# Altium schematic sheet PCIE x1 Edge Connector Interface.SchDoc
size Tabloid; DrawnBy: Krutav Shah; SheetNumber: 4; SheetTotal: 6
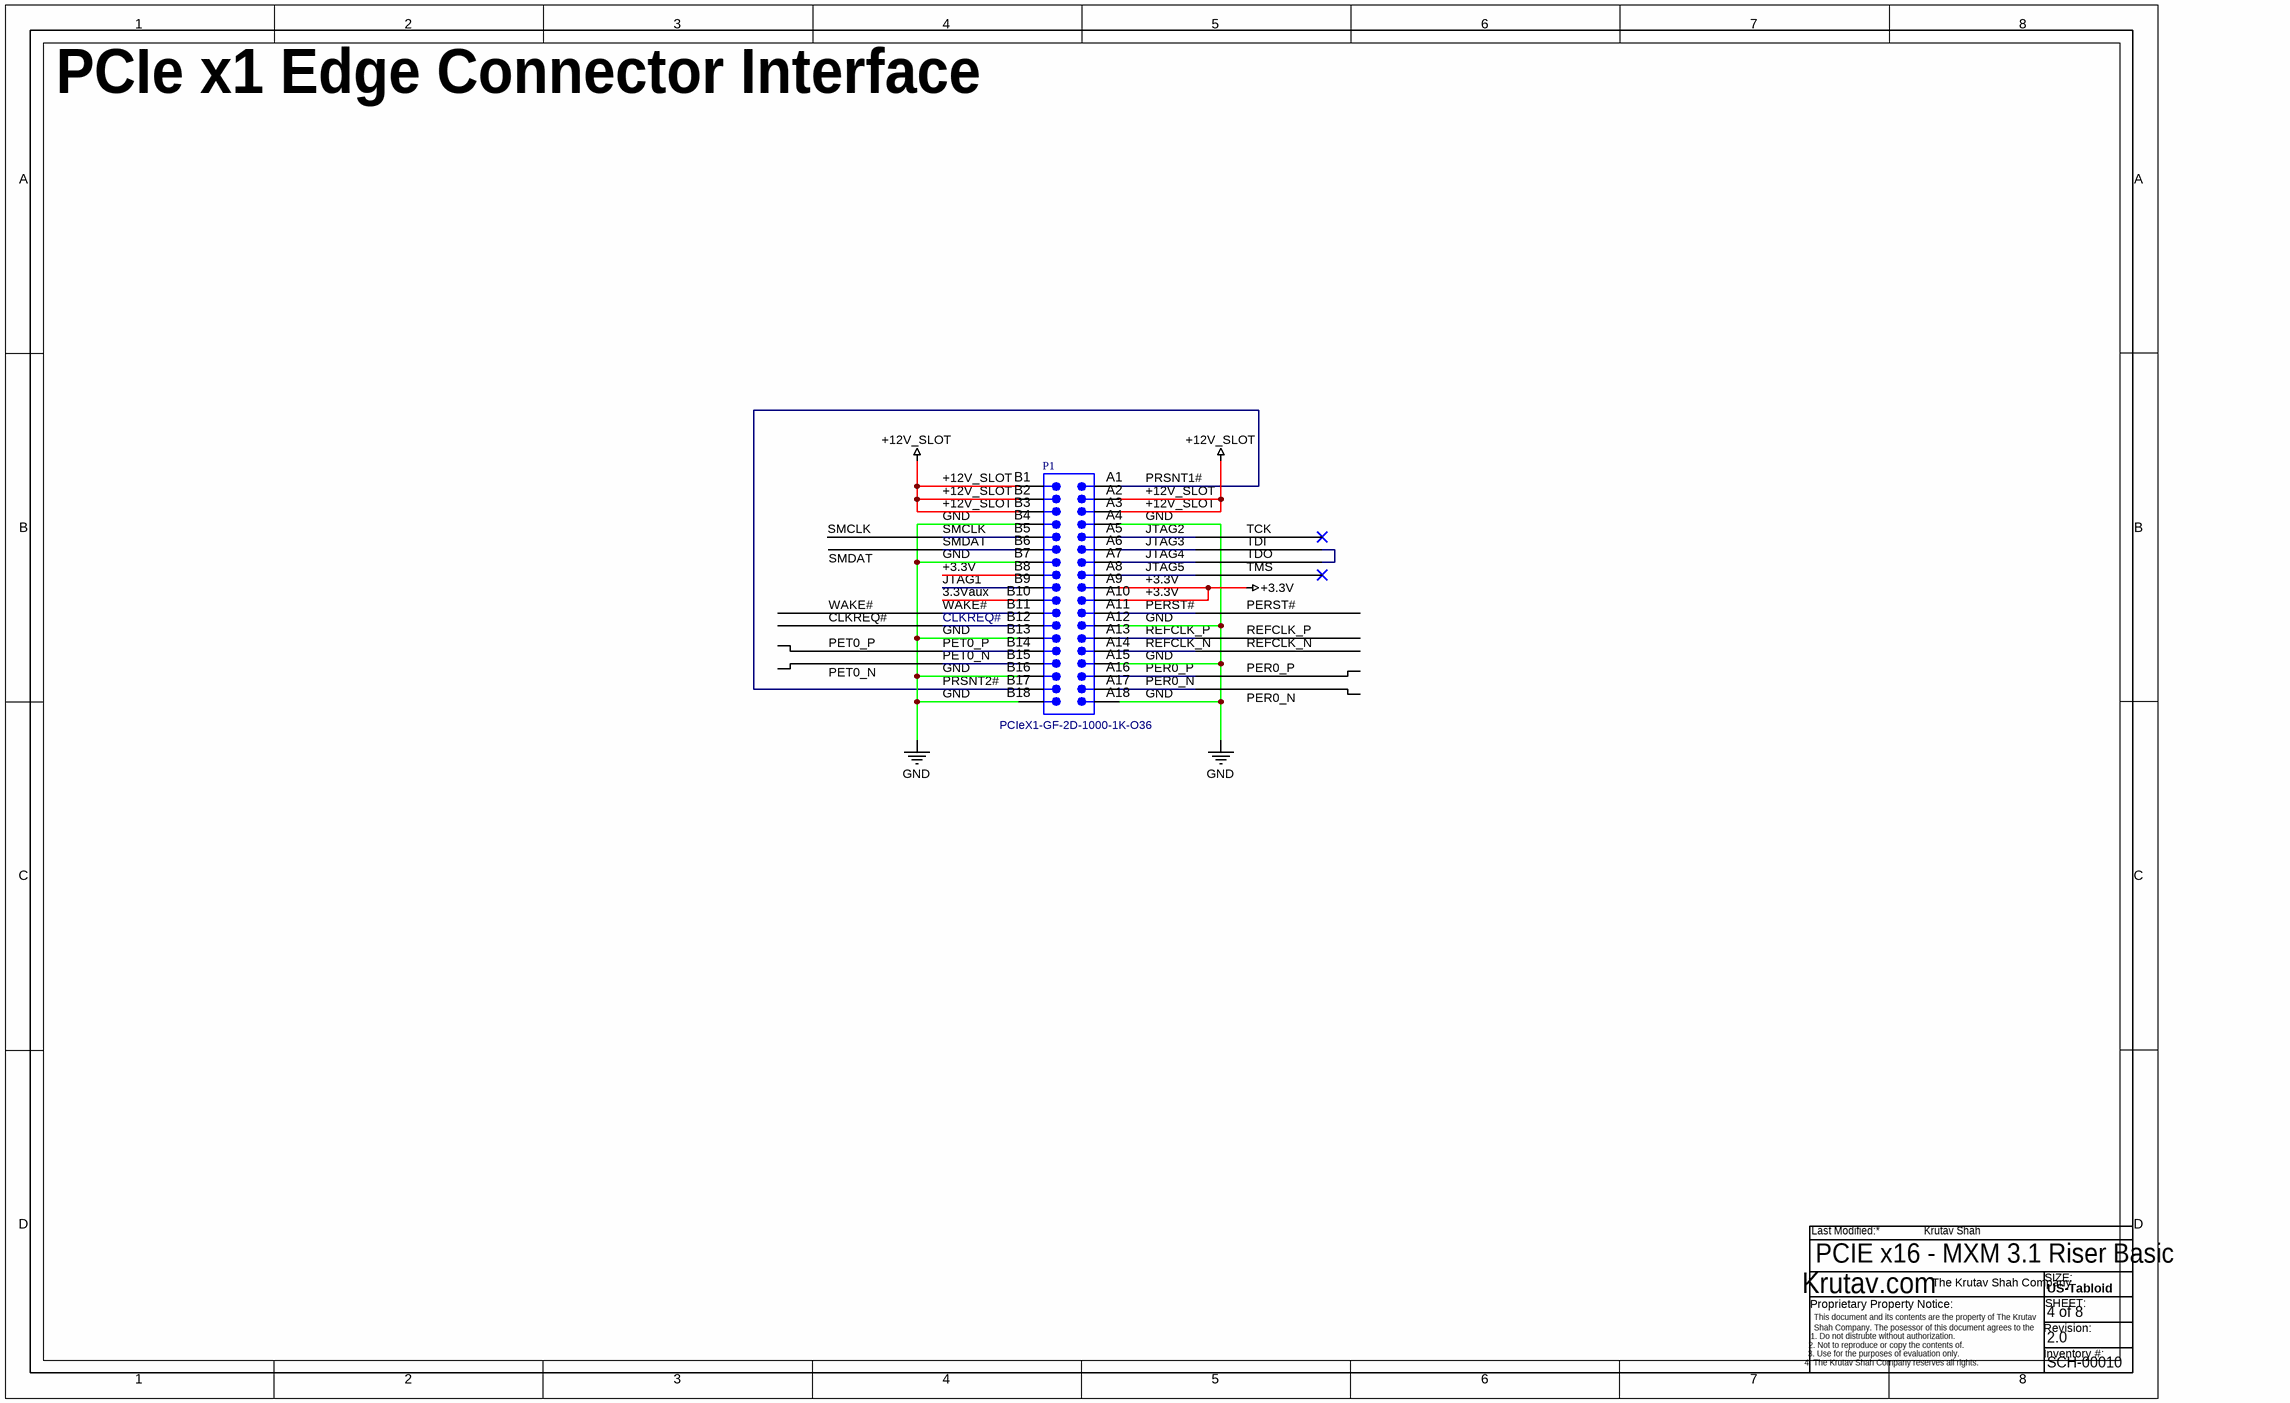
[diagram p0: PCIE x1 Edge Connector Interface.SchDoc]

## Parts
P1  PCIeX1-GF-2D-1000-1K-O36  [PCIeX1-GF-2D-1000-1K-O36]  (no BOM)

## Nets
+3.3V: P1.A9 P1.A10 P1.B8
+12V_SLOT: P1.A2 P1.A3 P1.B1 P1.B2 P1.B3
GND: P1.A4 P1.A12 P1.A15 P1.A18 P1.B4 P1.B7 P1.B13 P1.B16 P1.B18
3.3Vaux: P1.B10
CLKREQ#: P1.B12
JTAG1: P1.B9
JTAG2: P1.A5  [also labelled TCK]
JTAG3: P1.A6 P1.A7  [also labelled JTAG4, TDI, TDO]
JTAG5: P1.A8  [also labelled TMS]
PER0_N: P1.A17
PER0_P: P1.A16
PERST#: P1.A11
PET0_N: P1.B15
PET0_P: P1.B14
PRSNT1#: P1.A1 P1.B17  [also labelled PRSNT2#]
REFCLK_N: P1.A14
REFCLK_P: P1.A13
SMCLK: P1.B5
SMDAT: P1.B6
WAKE#: P1.B11

## Layout directives
differential pair: PER0_N, PER0_P, PET0_N, PET0_P, REFCLK_N, REFCLK_P

## Notes on the sheet
- PCIe x1 Edge Connector Interface
- CLKREQ#
- PCIE x16 - MXM 3.1 Riser Basic
- 4 of 8
- 2.0
- SCH-00010
- Last Modified:
- Krutav.com
- The Krutav Shah Company
- US-Tabloid
- SIZE:
- SHEET:
- This document and its contents are the property of The Krutav Shah Company. The posessor of this document agrees to the following:
- Proprietary Property Notice:
- 1. Do not distrubte without authorization.
- 3. Use for the purposes of evaluation only.
- 2. Not to reproduce or copy the contents of.
- 4. The Krutav Shah Company reserves all rights.
- Revision:
- Inventory #:

## Library data of the parts
P1 = CMP-0001-00030-2: Golden finger, PCIeX1, Dual, Opposite, Pitch 1mm, 36-Position; Mating Connector: Molex-87715-9006; Package Reference: PCIeX1-GF-2D-1000-1K-O36; ClassName: Edge Connector; Publisher: Altium; Datasheet Version: rev2.0, Apr-2007